# Altium project Intermediate_Board'.PrjPcb
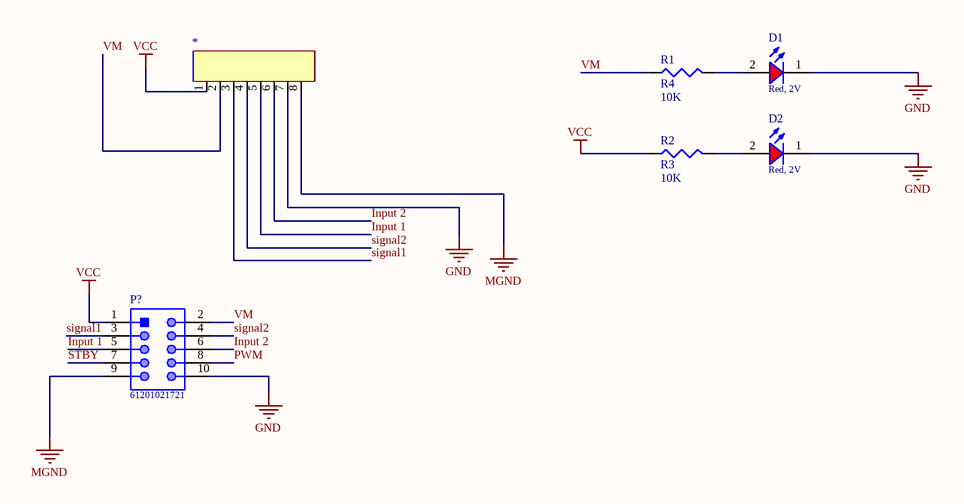
[diagram p0: Inter_sch.SchDoc]
1 sheet, 6 parts. Net scope: global (net labels, ports and power ports of the same name join across sheets).
Board file: Inter_pcb.PcbDoc

## Sheet Inter_sch.SchDoc
size A2

### Parts
*  1747785-1  [1747785-1]  (value not drawn)
D1  Red, 2V  [WL-SMSW_0603_Rectangular]
D2  Red, 2V  [WL-SMSW_0603_Rectangular]
P1  61201021721  [61201021721]
R1  R4  value 10K  [J1-0603]
R2  R3  value 10K  [J1-0603]

### Nets
GND: *.7 D1.1(K) D2.1(K) P1.10
MGND: *.8 P1.9
VCC: *.1 P1.1 R2.1
Input 1: *.5 P1.5
Input 2: *.6 P1.6
PWM: P1.8
signal1: *.3 P1.3
signal2: *.4 P1.4
STBY: P1.7
VM: *.2 P1.2 R1.1
NetD1_2: D1.2(A) R1.2
NetD2_2: D2.2(A) R2.2

### Library data of the parts
D1 D2 = 155060RS75300: WL-SMSW SMT Mono-color Side View Waterclear, size 0603, Red, 2V, 140deg; Manufacturer: Wurth Elektronik; Chip Technology: AlInGaP; Dominant Wavelength typ.: 625nm; Luminous Intensity typ.: 150mcd; Peak Wavelength typ.: 630nm; Viewing Angle: 140deg; ComponentLink1Description: Manufacturer; ComponentLink1URL: http://www.we-online.de; ComponentLink2URL: https://www.we-online.com/catalog/datasheet/155060RS75300.pdf; ComponentLink2Description: Datasheet; Forward Voltage typ.: 2V; Emitting Color: Red; Mounting Technology: SMT; Operating Temperature: -40 to +85degC; Published Date: October 2020; Manufacturer Part Number: 155060RS75300; Packaging: Tape and Reel; Size: 0603
P1 = CMP-1502-00021-1: Male Box Header WR-BHD, THT, Angled, pitch 2.54 mm, 10 pins; Manufacturer: Wurth Elektronik; Pin Number: 10; Contact Resistance: 20mOhm; Working Voltage: 250VAC; Pitch: 2.54mm; Withstanding Voltage: 500VAC; Mounting Technology: THT; Publisher: WurthElektronik; Gender: Male; Part Number: 61201021721; Package Reference: 61201021721; Orientation: Angled; Published Date: August2018; Packaging: Tray; Manufacturer URL: http://www.we-online.de; Operating Temperature: -40to125degC; Datasheet URL: https://katalog.we-online.de/em/datasheet/6120xx21721.pdf
R1 R2 = Res3: Resistor; Published: 8-Jun-2000; LatestRevisionDate: 29-May-2009; LatestRevisionNote: IPC-7351 Footprint Added.; PackageReference: J1-0603; Publisher: Altium Limited; PackageDescription: Chip Resistor